# EAGLE design peregigateli (EAGLE 7.5.0)
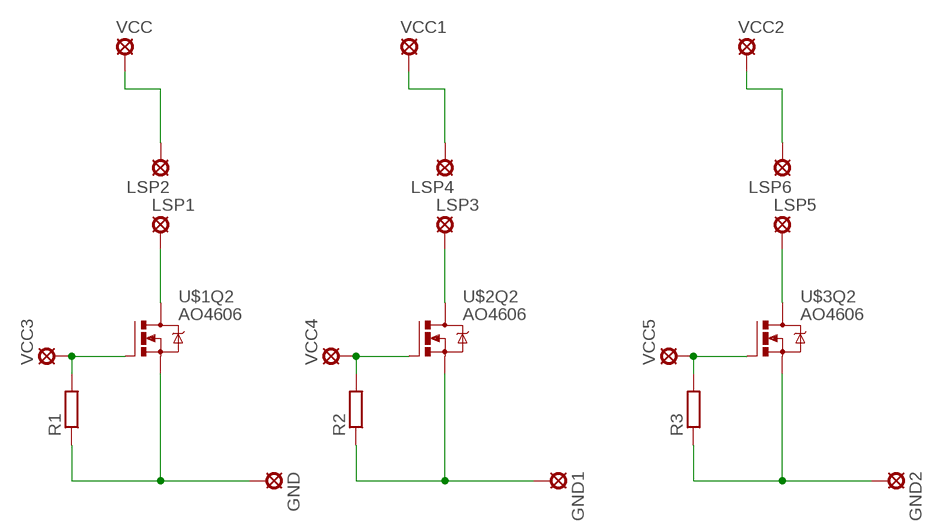
[diagram p0: schematic, sheet 1]

## Parts
GND  LSP10  [LSP10]
GND1  LSP10  [LSP10]
GND2  LSP10  [LSP10]
LSP1  LSP10  [LSP10]
LSP2  LSP10  [LSP10]
LSP3  LSP10  [LSP10]
LSP4  LSP10  [LSP10]
LSP5  LSP10  [LSP10]
LSP6  LSP10  [LSP10]
R1  R-EU_0207/10  [0207/10]
R2  R-EU_0207/10  [0207/10]
R3  R-EU_0207/10  [0207/10]
U$1  AO4606  [SOIC-8]
U$2  AO4606  [SOIC-8]
U$3  AO4606  [SOIC-8]
VCC  LSP10  [LSP10]
VCC1  LSP10  [LSP10]
VCC2  LSP10  [LSP10]
VCC3  LSP10  [LSP10]
VCC4  LSP10  [LSP10]
VCC5  LSP10  [LSP10]

## Nets
N$1: LSP1.MP U$1.7(Q2:D) U$1.8(Q2:D)
N$2: R1.2 U$1.2(Q2:G) VCC3.MP
N$3: GND.MP R1.1 U$1.1(Q2:S)
N$4: LSP3.MP U$2.7(Q2:D) U$2.8(Q2:D)
N$5: LSP4.MP VCC1.MP
N$6: GND1.MP R2.1 U$2.1(Q2:S)
N$7: LSP5.MP U$3.7(Q2:D) U$3.8(Q2:D)
N$8: LSP6.MP VCC2.MP
N$9: GND2.MP R3.1 U$3.1(Q2:S)
N$10: LSP2.MP VCC.MP
N$11: R2.2 U$2.2(Q2:G) VCC4.MP
N$12: R3.2 U$3.2(Q2:G) VCC5.MP
Unconnected: U$1.3(Q1:S) U$1.4(Q1:G) U$1.5(Q1:D) U$1.6(Q1:D) U$2.3(Q1:S) U$2.4(Q1:G) U$2.5(Q1:D) U$2.6(Q1:D) U$3.3(Q1:S) U$3.4(Q1:G) U$3.5(Q1:D) U$3.6(Q1:D)

## Library data of the parts
GND GND1 GND2 LSP1-LSP6 VCC VCC1-VCC5 = solpad:LSP10: SOLDER PAD drill 1.0 mm, distributor Buerklin, 12H555
R1-R3 = resistor:R-EU_: RESISTOR, European symbol
U$1-U$3 = elements:AO4606: Complementary MOSFET A04606 The AO4606 uses advanced trench technology MOSFETs to provide excellent RDS(ON) and low gate charge. The complementary MOSFETs may be used to form a level shifted high side switch, and for a host of other applications. http://www.aosmd.com/pdfs/datasheet/ao4606.pdf

## Board
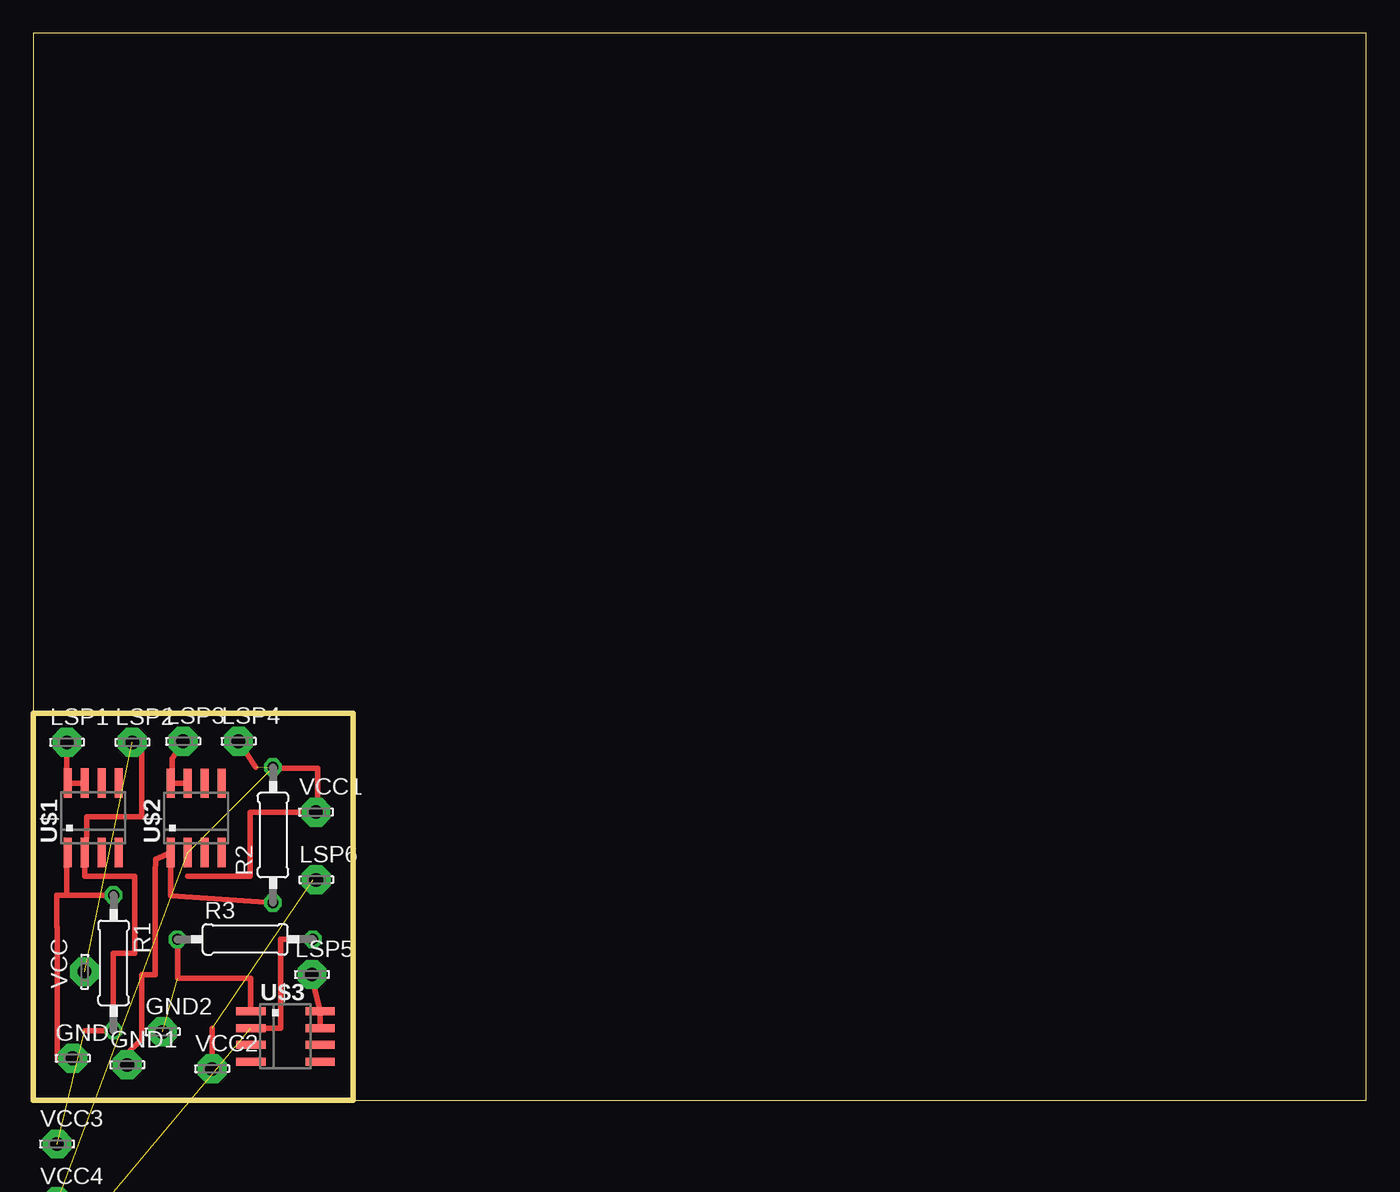
[diagram p1: board, top side]

Size 100 x 80 mm. Coordinates in mm from the lower left corner, seen from the top.
Outline: 24,0 100,0 100,80 0,80 0,29
Outline: 0,29 0,0 24,0
Outline: 0,29 24,29 24,0
Copper layers (1*16): Top 0.035mm / dielectric 1.5mm / Bottom 0.035mm
Design rules "default": minimum track width 10mil, minimum drill 24mil, track to track 8mil, track to pad 8mil, pad to pad 8mil, via to via 8mil, smd to smd 8mil, copper to edge 40mil, drill to drill 8mil, minimum pad ring 10mil, minimum via ring 8mil, stop-mask expansion 4mil, vias tented up to drill 0mil, thermal gap 10mil

### Footprints (pad centres in the part's own frame; a part is rotated, then mirrored left to right if it is on the bottom)
LSP10 = drill 1.016 pad 2.159 octagon: MP 0,0
0207/10 = drill 0.813 octagon: 1 -5.08,0; 2 5.08,0
SOIC-8 = smd 0.6 x 2.2: 1 -1.905,-2.6; 2 -0.635,-2.6; 3 0.635,-2.6; 4 1.905,-2.6; 5 1.905,2.6; 6 0.635,2.6; 7 -0.635,2.6; 8 -1.905,2.6

### Placement (x,y rotation side)
GND  2.95,3.13 0 top
GND1  7.04,2.63 0 top
GND2  9.69,5.11 0 top
LSP1  2.52,26.83 0 top
LSP2  7.42,26.83 0 top
LSP3  11.24,26.91 0 top
LSP4  15.39,26.91 0 top
LSP5  20.9,9.42 0 top
LSP6  21.22,16.51 0 top
R1  6.02,10.28 270 top
R2  17.98,19.88 90 top
R3  15.9,12.05 0 top
U$1  4.49,21.16 0 top
U$2  12.22,21.16 0 top
U$3  18.92,4.76 270 top
VCC  3.85,9.63 90 top
VCC1  21.2,21.59 0 top
VCC2  13.41,2.34 0 top
VCC3  1.78,-3.3 0 top  (outside the outline)
VCC4  1.78,-7.62 0 top  (outside the outline)
VCC5  1.78,-11.94 0 top  (outside the outline)

### Tracks (layer width: path | path; a pad name or v marks a point on that pad's centre or on a via)
N$1
  Top 0.406: U$1.7 U$1.8 2.52,25.1 LSP1.MP
N$2  (1 unrouted)
  Top 0.406: 3.85,5.2 R1.2 6,5.71 6,11 7.62,11 7.62,16.76 3.85,16.76 U$1.2 4,19.83 4,21.25 8.13,21.25 8.13,26.16 7.42,26.16
N$3
  Top 0.406: R1.1 2.51,15.36 | 2.51,15.36 2.51,18.76 2.58,18.76 U$1.1 | GND.MP 1.78,3.13 1.78,12.95 1.75,12.95 1.75,15.36 2.51,15.36
N$4
  Top 0.406: U$2.7 U$2.8 10.41,23.76 10.41,25.58 LSP3.MP
N$5  (1 unrouted)
  Top 0.406: LSP4.MP 16.66,24.96 | 17.98,24.89 21.34,24.89 21.34,21.59 VCC1.MP 16.26,21.59 16.26,16.76 11.59,16.76
N$6
  Top 0.406: R2.1 10.31,15.3 U$2.1 9.16,18.05 9.14,17.02 9.14,9.4 8.13,9.4 8.13,4.57 6.86,3.3 7.04,3.3 GND1.MP
N$7
  Top 0.406: U$3.7 U$3.8 21.01,8.65 LSP5.MP
N$8  (1 unrouted)
  Top 0.406: 20.98,16.51 LSP6.MP | VCC2.MP 13.41,5.4
N$9  (1 unrouted)
  Top 0.406: R3.1 10.82,9.14 16.32,9.14 U$3.1
N$10  (1 unrouted)
N$11  (2 unrouted)
N$12  (1 unrouted)
  Top 0.406: R3.2 18.54,12.05 18.54,5.4 U$3.2